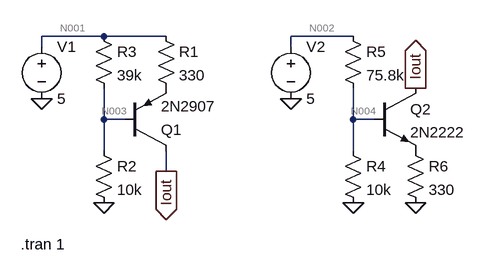
[diagram p0: schematic SingleCurrent.asc]
SingleCurrent.asc, the LTspice schematic file:
Version 4
SHEET 1 880 680
WIRE 272 -16 176 -16
WIRE 368 -16 272 -16
WIRE 656 -16 560 -16
WIRE 176 0 176 -16
WIRE 560 0 560 -16
WIRE 272 112 272 64
WIRE 304 112 272 112
WIRE 656 112 656 64
WIRE 688 112 656 112
WIRE 272 160 272 112
WIRE 656 160 656 112
WIRE 368 192 368 160
FLAG 272 240 0
FLAG 176 80 0
FLAG 368 192 Iout
IOPIN 368 192 Out
FLAG 656 240 0
FLAG 560 80 0
FLAG 752 240 0
FLAG 752 64 Iout
IOPIN 752 64 Out
SYMBOL res 256 144 R0
SYMATTR InstName R2
SYMATTR Value 10k
SYMBOL res 256 -32 R0
SYMATTR InstName R3
SYMATTR Value 39k
SYMBOL voltage 176 -16 R0
WINDOW 123 0 0 Left 0
WINDOW 39 0 0 Left 0
SYMATTR InstName V1
SYMATTR Value 5
SYMBOL res 352 -32 R0
SYMATTR InstName R1
SYMATTR Value 330
SYMBOL pnp 304 160 M180
SYMATTR InstName Q1
SYMATTR Value 2N2907
SYMBOL res 640 144 R0
SYMATTR InstName R4
SYMATTR Value 10k
SYMBOL res 640 -32 R0
SYMATTR InstName R5
SYMATTR Value 75.8k
SYMBOL voltage 560 -16 R0
WINDOW 123 0 0 Left 0
WINDOW 39 0 0 Left 0
SYMATTR InstName V2
SYMATTR Value 5
SYMBOL npn 688 64 R0
SYMATTR InstName Q2
SYMATTR Value 2N2222
SYMBOL res 736 144 R0
SYMATTR InstName R6
SYMATTR Value 330
TEXT 144 304 Left 2 !.tran 1

The netlist it stands for:
* SingleCurrent.asc
R2 N003 0 10k
R3 N001 N003 39k
V1 N001 0 5
R1 N001 P001 330
Q1 Iout N003 P001 0 2N2907
R4 N004 0 10k
R5 N002 N004 75.8k
V2 N002 0 5
Q2 Iout N004 P002 0 2N2222
R6 P002 0 330
.model NPN NPN
.model PNP PNP
.lib standard.bjt
.tran 1
.backanno
.end

* Results of the author's LTspice run, read from the files saved beside the schematic
* Operating Point, zero values left out:
*   V(n003) = 4.185 V
*   V(n001) = 5 V
*   V(p001) = 4.857 V
*   V(iout) = 4.848 V
*   V(n004) = 581.2 mV
*   V(n002) = 5 V
*   V(p002) = 12.31 mV
*   Ic(Q2) = 37.13 µA
*   Ib(Q2) = 178.1 nA
*   Ie(Q2) = -37.31 µA
*   Ic(Q1) = -37.13 µA
*   Ib(Q1) = -397.6 µA
*   Ie(Q1) = 434.7 µA
*   I(R6) = 37.31 µA
*   I(R5) = 58.3 µA
*   I(R4) = 58.12 µA
*   I(R1) = 434.7 µA
*   I(R3) = 20.9 µA
*   I(R2) = 418.5 µA
*   I(V2) = -58.3 µA
*   I(V1) = -455.6 µA